# Altium schematic sheet amp.SchDoc: Signal Path AMP
size A4; Organization: Altium Limited; Address1: L3, 12a Rodborough Rd; Address2: Frenchs Forest; Address3: NSW; Address4: Australia 2086
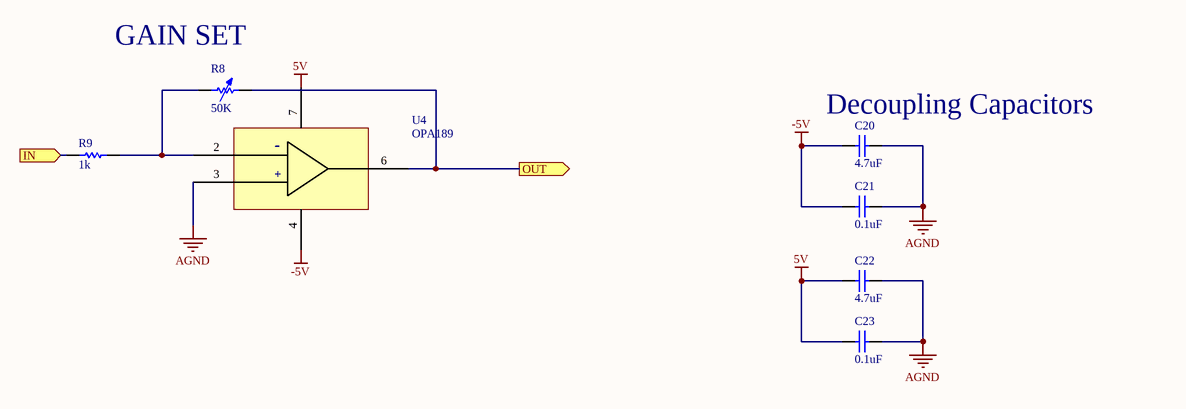
[diagram p0: amp.SchDoc]

## Parts
C20  4.7uF  [0402_Cap]
C21  0.1uF  [0402_Cap]
C22  4.7uF  [0402_Cap]
C23  0.1uF  [0402_Cap]
R8  50K  [TRIMRES]
R9  1k  [0402_Res]
U4  OPA189  [SOIC_8]

## Ports
IN (in), OUT (out)

## Nets
5V: C22.1 C23.1 U4.7
-5V: C20.1 C21.1 U4.4
AGND: C20.2 C21.2 C22.2 C23.2 U4.3
IN: R9.1 ; port IN
OUT: R8.2 U4.6 ; port OUT
NetR8_1: R8.1 R9.2 U4.2

## Notes on the sheet
- (near R8) GAIN SET
- (near C20) Decoupling Capacitors
- Title
- Date:
- RE:
- Arturo di Girolamo
- Size:
- A3
- A
- (in symbol OPA189IDR) -; +

## Library data of the parts
C20 C22 = CL21A475KAQNNNE: Capacitor, 4.7uF, 0805; Value: .01uf; ASYPN: GRM155R61A475MEAAD; MFGPN: CL21A475KAQNNNE
C21 C23 = CL21B104KACNNNC: Capacitor, 0.1uF, 0805; Value: .01uf; ASYPN: 0402YC104KAT2A; MFGPN: CL21B104KACNNNC
R8 = 3296W-1-103LF: Variable Resistor; MFGPN: 3296W-1-103LF
R9 = RNCP0805FTD1K00: 1K 1% 1/4W; ASYPN: RMCF0402FT1K00; Value: 1K; MFGPN: RNCP0805FTD1K00
U4 = OPA189IDR: Precision OpAmp, Generic; MFGPN: OPA189IDR; ASYPN: OPA189ID